# EAGLE design ActiveDebugger8p1 (EAGLE 9.6.2)
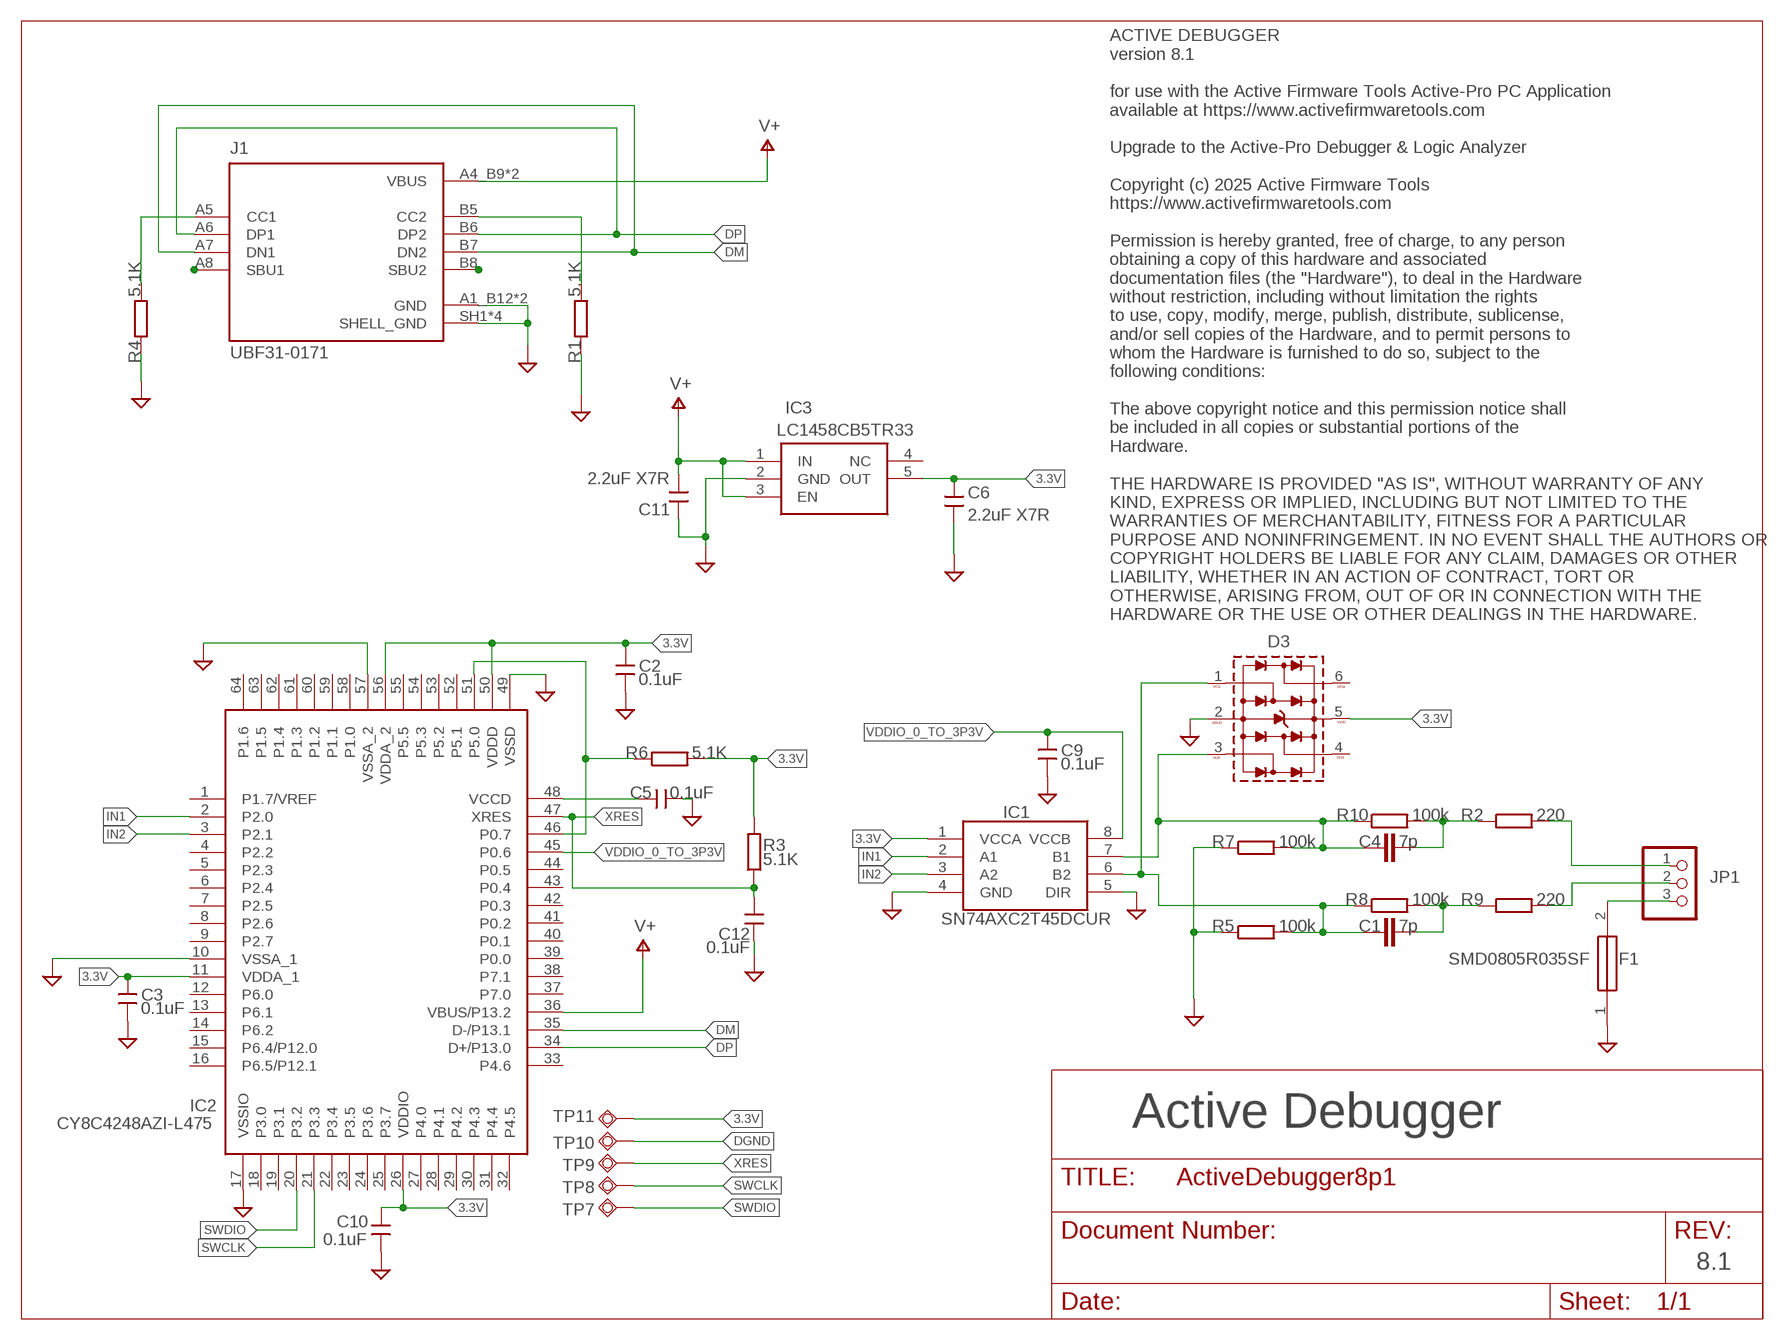
[diagram p0: schematic, sheet 1]

## Parts
C1  7p  C-EUC0603  [C0603]
C2  0.1uF  CAP0603  [0603]
C3  0.1uF  CAP0603  [0603]
C4  7p  C-EUC0603  [C0603]
C5  0.1uF  CAP0603  [0603]
C6  2.2uF X7R  CAP  [0805]
C9  0.1uF  CAP0603  [0603]
C10  0.1uF  CAP0603  [0603]
C11  2.2uF X7R  CAP  [0805]
C12  0.1uF  CAP0603  [0603]
D3  5Vdc  WE-TVS-HS_SC70-6L_82400274  [WE-TVS_SC70-6L]
F1  SMD0805R035SF  SMD0805B010TF  [FUSC2114X100N]
IC1  SN74AXC2T45DCUR  SN74AXCH2T45DCUR  [SOP50P310X90-8N]
IC2  CY8C4248AZI-L475  [QFP50P1200X1200X160-64N]
IC3  LC1458CB5TR33  TLV70233DBVR  [SOT95P280X145-5N]
J1  UBF31-0171  USB4105GFA120  [GCT_USB4105GFA120]
JP1  P125-1103A0BR138A1  PINHD-1X3  [1X03]
R1  5.1K  R-EU_R0603  [R0603]
R2  220  R-EU_R0603  [R0603]
R3  5.1K  R-EU_R0603  [R0603]
R4  5.1K  R-EU_R0603  [R0603]
R5  100k  R-EU_R0603  [R0603]
R6  5.1K  R-EU_R0603  [R0603]
R7  100k  R-EU_R0603  [R0603]
R8  100k  R-EU_R0603  [R0603]
R9  220  R-EU_R0603  [R0603]
R10  100k  R-EU_R0603  [R0603]
TP7  TPSQTP20R  [TP20R]
TP8  TPSQTP20R  [TP20R]
TP9  TPSQTP20R  [TP20R]
TP10  TPSQTP20R  [TP20R]
TP11  TPSQTP20SQ  [TP20SQ]

## Nets
3.3V: C2.1(X) C3.1(X) C6.2(Y) C10.1(X) D3.5(VDD) IC1.1(VCCA) IC2.11(VDDA_1) IC2.26(VDDIO) IC2.50(VDDD) IC2.56(VDDA_2) IC3.5(OUT) R3.2 R6.2 TP11.TP
DGND: C2.2(Y) C3.2(Y) C5.2(Y) C6.1(X) C9.2(Y) C10.2(Y) C11.1(X) C12.1(X) D3.2(GND) F1.1 IC1.4(GND) IC1.5(DIR) IC2.10(VSSA_1) IC2.17(VSSIO) IC2.49(VSSD) IC2.57(VSSA_2) IC3.2(GND) J1.A1_B12(GND) J1.B1_A12(GND) J1.SH1(SHELL_GND) J1.SH2(SHELL_GND) J1.SH3(SHELL_GND) J1.SH4(SHELL_GND) R1.1 R4.1 R5.1 R7.1 TP10.TP
DIN0: JP1.1 R2.2
DIN1: JP1.2 R9.2
DM: IC2.35(D-/P13.1) J1.A7(DN1) J1.B7(DN2)
DP: IC2.34(D+/P13.0) J1.A6(DP1) J1.B6(DP2)
DP0: C4.1 D3.3 IC1.7(B1) R7.2 R10.1
DP1: C1.1 D3.1 IC1.6(B2) R5.2 R8.1
IN1: IC1.2(A1) IC2.2(P2.0)
IN2: IC1.3(A2) IC2.3(P2.1)
N$3: C4.2 R2.1 R10.2
N$4: F1.2 JP1.3
N$5: IC2.46(P0.7) IC2.51(P5.0) R6.1
N$6: J1.A8(SBU1)
N$7: C5.1(X) IC2.48(VCCD)
N$8: J1.A5(CC1) R4.2
N$9: J1.B5(CC2) R1.2
N$10: J1.B8(SBU2)
N$11: C1.2 R8.2 R9.1
SWCLK: IC2.21(P3.3) TP8.TP
SWDIO: IC2.20(P3.2) TP7.TP
V+: C11.2(Y) IC2.36(VBUS/P13.2) IC3.1(IN) IC3.3(EN) J1.A4_B9(VBUS) J1.B4_A9(VBUS)
VDDIO_0_TO_3P3V: C9.1(X) IC1.8(VCCB) IC2.45(P0.6)
XRES: C12.2(Y) IC2.47(XRES) R3.1 TP9.TP
Unconnected: D3.4 D3.6 IC2.1(P1.7/VREF) IC2.4(P2.2) IC2.5(P2.3) IC2.6(P2.4) IC2.7(P2.5) IC2.8(P2.6) IC2.9(P2.7) IC2.12(P6.0) IC2.13(P6.1) IC2.14(P6.2) IC2.15(P6.4/P12.0) IC2.16(P6.5/P12.1) IC2.18(P3.0) IC2.19(P3.1) IC2.22(P3.4) IC2.23(P3.5) IC2.24(P3.6) IC2.25(P3.7) IC2.27(P4.0) IC2.28(P4.1) IC2.29(P4.2) IC2.30(P4.3) IC2.31(P4.4) IC2.32(P4.5) IC2.33(P4.6) IC2.37(P7.0) IC2.38(P7.1) IC2.39(P0.0) IC2.40(P0.1) IC2.41(P0.2) IC2.42(P0.3) IC2.43(P0.4) IC2.44(P0.5) IC2.52(P5.1) IC2.53(P5.2) IC2.54(P5.3) IC2.55(P5.5) IC2.58(P1.0) IC2.59(P1.1) IC2.60(P1.2) IC2.61(P1.3) IC2.62(P1.4) IC2.63(P1.5) IC2.64(P1.6) IC3.4(NC)

## Notes on the sheet
- ACTIVE DEBUGGER
  version 8.1
  
  for use with the Active Firmware Tools Active-Pro PC Application
  available at https://www.activefirmwaretools.com
  
  Upgrade to the Active-Pro Debugger & Logic Analyzer 
  
  Copyright (c) 2025 Active Firmware Tools
  https://www.activefirmwaretools.com
  
  Permission is hereby granted, free of charge, to any person
  obtaining a copy of this hardware and associated
  documentation files (the "Hardware"), to deal in the Hardware
  without restriction, including without limitation the rights
  to use, copy, modify, merge, publish, distribute, sublicense,
  and/or sell copies of the Hardware, and to permit persons to
  whom the Hardware is furnished to do so, subject to the
  following conditions:
  
  The above copyright notice and this permission notice shall
  be included in all copies or substantial portions of the
  Hardware.
  
  THE HARDWARE IS PROVIDED "AS IS", WITHOUT WARRANTY OF ANY
  KIND, EXPRESS OR IMPLIED, INCLUDING BUT NOT LIMITED TO THE 
  WARRANTIES OF MERCHANTABILITY, FITNESS FOR A PARTICULAR 
  PURPOSE AND NONINFRINGEMENT. IN NO EVENT SHALL THE AUTHORS OR
  COPYRIGHT HOLDERS BE LIABLE FOR ANY CLAIM, DAMAGES OR OTHER 
  LIABILITY, WHETHER IN AN ACTION OF CONTRACT, TORT OR 
  OTHERWISE, ARISING FROM, OUT OF OR IN CONNECTION WITH THE 
  HARDWARE OR THE USE OR OTHER DEALINGS IN THE HARDWARE.
- Active Debugger
- 8.1

## Library data of the parts
C1 C4 = rcl:C-EU: CAPACITOR, European symbol; SPICEPREFIX: C
C2 C3 C5 C9 C10 C12 = USBeeRX:CAP0603
C6 C11 = USBeeRX:CAP
D3 = Wurth_EMC Components_WE-TVS:WE-TVS-HS_SC70-6L_82400274: WE-TVS TVS Diode – High Speed Series Characteristics Low clamping voltage Sturdy design Very low capacitance Flow Thru Design for a simple layout Rail to Rail protection Epoxy flame resistant UL94-V0 RoHS, REACH and free of halogens Applications Very fast data lines USB 2.0 Ethernet PoE VGA Sim Cards Keypads HS = High Speed <https://katalog.we-online.com/media/images/v2/o14883v209%20Family_WE-TVS_HIGHSPEED.> Details see: https://katalog.we-online.com/en/pbs/WE-TVS-HS Updated by Ella Wu 2019-07-12 2019 (C) Wurth Elektronik; C-CH: 1.2pF; CHANNELS: 4+1; DATASHEET-URL: https://www.we-online.com/catalog/datasheet/82400274.pdf; IPEAK: 6A; MOUNT: SMT; PART-NUMBER: 82400274; VBR: 6V
F1 = SMD0805B010TF:SMD0805B010TF: YAGEO - SMD0805B010TF - Resettable Fuse, PPTC, 0805 (2012 Metric), SMD0805 Series, 15 VDC, 100 mA, 300 mA, 1.5 s Source: Datasheet <https://g.componentsearchengine.com/Datasheets/2/SMD0805B010TF.pdf>; DESCRIPTION: YAGEO - SMD0805B010TF - Resettable Fuse, PPTC, 0805 (2012 Metric), SMD0805 Series, 15 VDC, 100 mA, 300 mA, 1.5 s; HEIGHT: 1mm; MANUFACTURER_NAME: YAGEO; MANUFACTURER_PART_NUMBER: SMD0805B010TF; MOUSER_PART_NUMBER: 603-SMD0805B010TF; MOUSER_PRICE-STOCK: https://www.mouser.co.uk/ProductDetail/YAGEO/SMD0805B010TF?qs=0lSvoLzn4L8aJ%252BcBO9%2FecQ%3D%3D
IC1 = SN74AXCH2T45DCUR:SN74AXCH2T45DCUR: Translation - Voltage Levels 2-bit 0.65V to 3.6V AXC dual-supply bus transciever with bus-hold 8-VSSOP -40 to 125 Source: Datasheet <https://pdf1.alldatasheet.net/datasheet-pdf/view/1213154/TI1/SN74AXCH2T45DCUR.html>; DESCRIPTION: Translation - Voltage Levels 2-bit 0.65V to 3.6V AXC dual-supply bus transciever with bus-hold 8-VSSOP -40 to 125; HEIGHT: 0.9mm; MANUFACTURER_NAME: Texas Instruments; MANUFACTURER_PART_NUMBER: SN74AXCH2T45DCUR; MOUSER_PART_NUMBER: 595-SN74AXCH2T45DCUR; MOUSER_PRICE-STOCK: https://www.mouser.co.uk/ProductDetail/Texas-Instruments/SN74AXCH2T45DCUR?qs=rI7uf1IzohT8gFhA5W5%252Bog%3D%3D
IC2 = CY8C4248AZI-L475:CY8C4248AZI-L475: Cypress Semiconductor CY8C4248AZI-L475, 32bit ARM Cortex M0 Microcontroller, 48MHz, 256 kB Flash, 64-Pin TQFP Source: Datasheet <http://www.cypress.com/file/222206/download>; ARROW_PART_NUMBER: CY8C4248AZI-L475; ARROW_PRICE-STOCK: https://www.arrow.com/en/products/cy8c4248azi-l475/cypress-semiconductor; DESCRIPTION: Cypress Semiconductor CY8C4248AZI-L475, 32bit ARM Cortex M0 Microcontroller, 48MHz, 256 kB Flash, 64-Pin TQFP; HEIGHT: 1.6mm; MANUFACTURER_NAME: Infineon; MANUFACTURER_PART_NUMBER: CY8C4248AZI-L475
IC3 = TLV70233DBVR:TLV70233DBVR: 300mA Low-Iq Low-Dropout (LDO) Regulator for Portables Source: Datasheet <http://www.ti.com/lit/gpn/tlv702>; DESCRIPTION: 300mA Low-Iq Low-Dropout (LDO) Regulator for Portables; HEIGHT: 1.45mm; MANUFACTURER_NAME: Texas Instruments; MANUFACTURER_PART_NUMBER: TLV70233DBVR; MOUSER_PART_NUMBER: 595-TLV70233DBVR; MOUSER_PRICE-STOCK: https://www.mouser.co.uk/ProductDetail/Texas-Instruments/TLV70233DBVR?qs=zQ2yIHQ6k3wiHrD0NUI05Q%3D%3D
J1 = USB4105GFA120:USB4105GFA120; MANUFACTURER: Global Connector Technology; MAXIMUM_PACKAGE_HEIGHT: 3.31mm; PARTREV: B3; STANDARD: Manufacturer Recommendations
JP1 = pinhead:PINHD-1X3: PIN HEADER
R1-R10 = rcl:R-EU_: RESISTOR, European symbol; SPICEPREFIX: R
TP7-TP11 = testpad:TPSQ: Test pad

## Net classes
0 default: width 0.102 mm, drill 0.152 mm

## Board
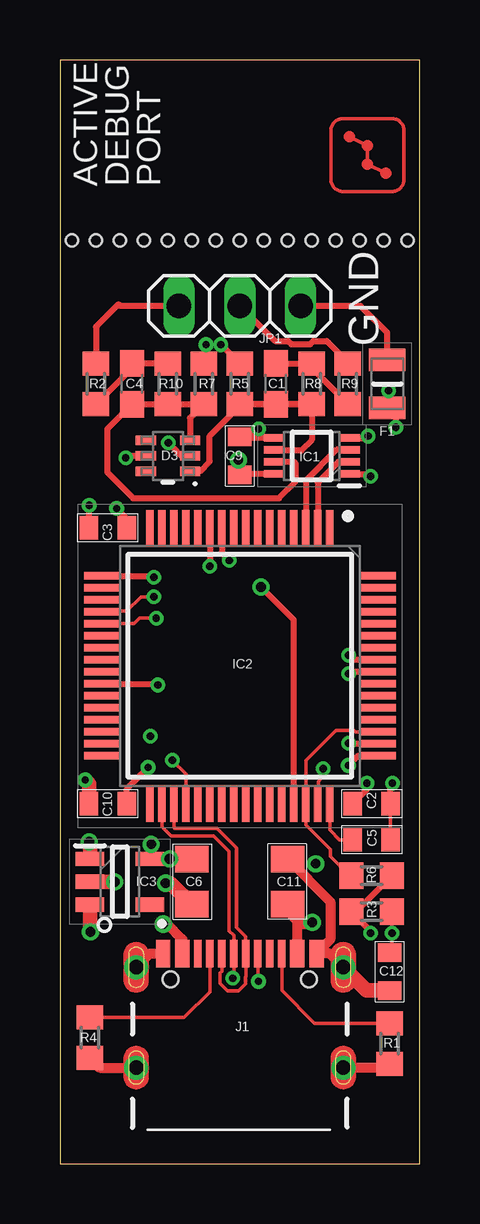
[diagram p1: board, top side]
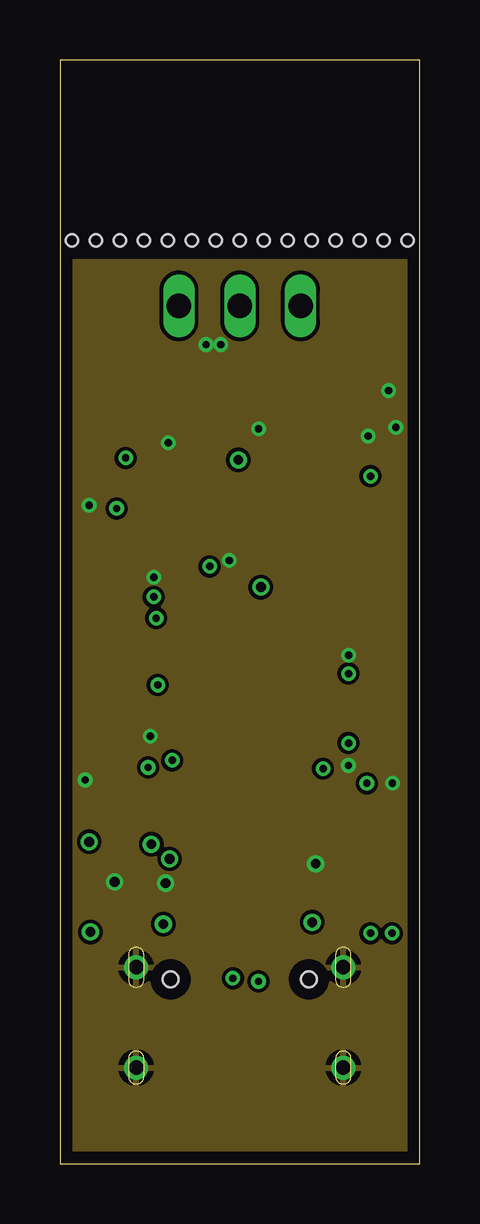
[diagram p2: board, inner layer GND]
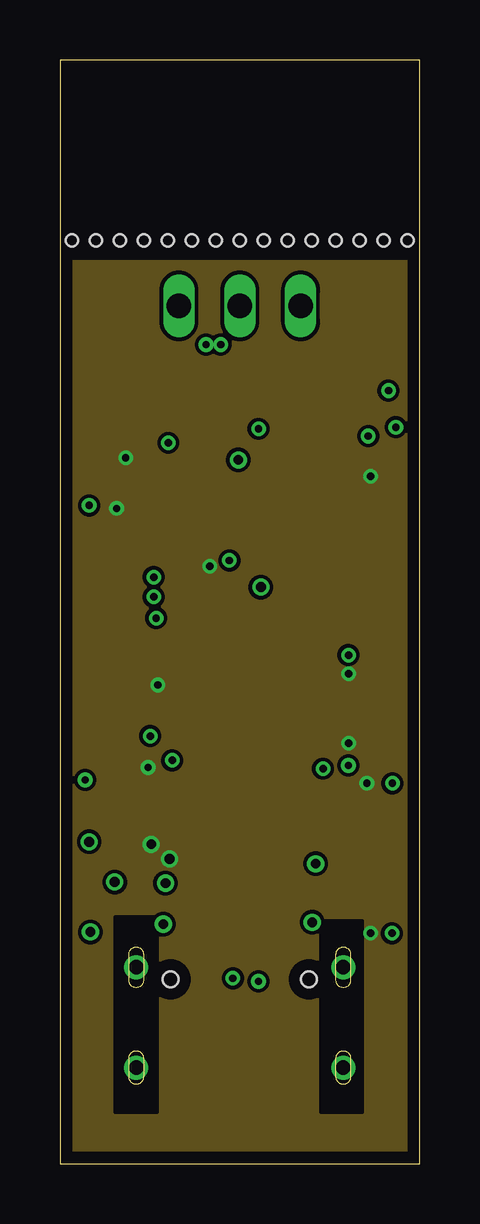
[diagram p3: board, inner layer POWER]
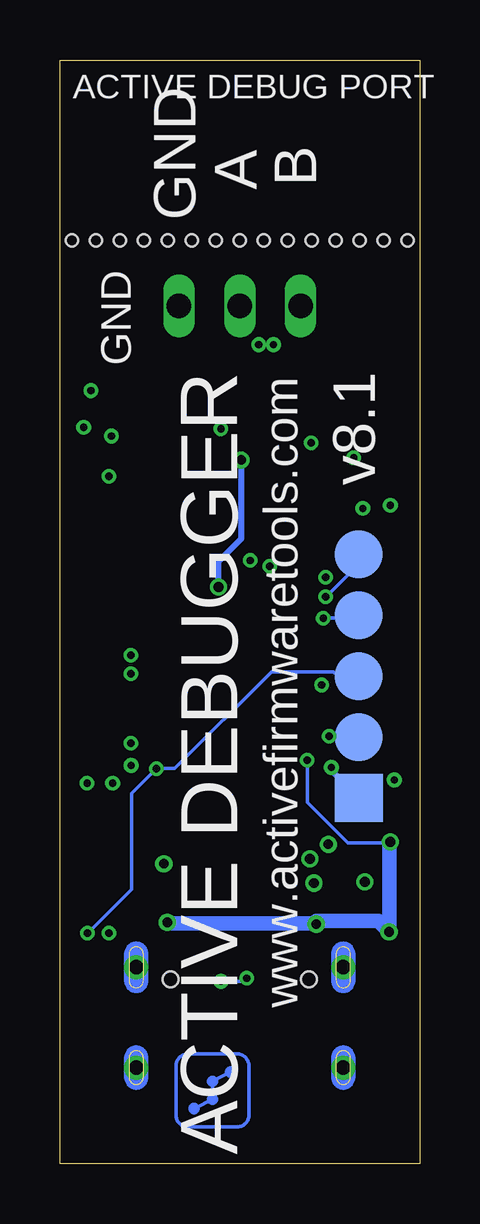
[diagram p4: board, bottom side, seen from below]

Size 15 x 46 mm. Coordinates in mm from the lower left corner, seen from the top.
Outline: 0,0 15,0 15,46 0,46 0,0
Copper layers (1+2*15+16): Top 0.035mm / dielectric 0.2mm / GND 0.035mm / dielectric 1.06mm / POWER 0.035mm / dielectric 0.2mm / Bottom 0.035mm
Design rules "default *": minimum track width 6mil, minimum drill 12mil, track to track 6mil, track to pad 6mil, pad to pad 6mil, via to via 6mil, smd to smd 0mil, copper to edge 20mil, drill to drill 10mil, minimum pad ring 6mil, minimum via ring 6mil, stop-mask expansion 1.5mil, vias tented up to drill 16mil, thermal gap 10mil
Holes 0.5 mm at 14.5,38.48 13.5,38.48 12.5,38.48 11.5,38.48 10.5,38.48 9.5,38.48 8.5,38.48 7.5,38.48 6.5,38.48 5.5,38.48 4.5,38.48 3.5,38.48 2.5,38.48 1.5,38.48 0.5,38.48

### Footprints (pad centres in the part's own frame; a part is rotated, then mirrored left to right if it is on the bottom)
C0603 = smd 1.1 x 1: 1 -0.85,0; 2 0.85,0
0603 = smd 0.762 x 0.965: 1 -0.787,0; 2 0.787,0
0805 = smd 1.092 x 1.397: 1 -0.94,0; 2 0.94,0
WE-TVS_SC70-6L = smd 0.4 x 0.85: 1 -0.65,-0.925; 2 0,-0.925; 3 0.65,-0.925; 4 0.65,0.925; 5 0,0.925; 6 -0.65,0.925
FUSC2114X100N = smd 0.93 x 1.52: 1 -1,0; 2 1,0
SOP50P310X90-8N = smd 0.85 x 0.3: 1 -1.575,0.75; 2 -1.575,0.25; 3 -1.575,-0.25; 4 -1.575,-0.75; 5 1.575,-0.75; 6 1.575,-0.25; 7 1.575,0.25; 8 1.575,0.75
QFP50P1200X1200X160-64N = smd 1.5 x 0.3: 1 -5.75,3.75; 2 -5.75,3.25; 3 -5.75,2.75; 4 -5.75,2.25; 5 -5.75,1.75; 6 -5.75,1.25; 7 -5.75,0.75; 8 -5.75,0.25; 9 -5.75,-0.25; 10 -5.75,-0.75; 11 -5.75,-1.25; 12 -5.75,-1.75; 13 -5.75,-2.25; 14 -5.75,-2.75; 15 -5.75,-3.25; 16 -5.75,-3.75; 33 5.75,-3.75; 34 5.75,-3.25; 35 5.75,-2.75; 36 5.75,-2.25; 37 5.75,-1.75; 38 5.75,-1.25; 39 5.75,-0.75; 40 5.75,-0.25; 41 5.75,0.25; 42 5.75,0.75; 43 5.75,1.25; 44 5.75,1.75; 45 5.75,2.25; 46 5.75,2.75; 47 5.75,3.25; 48 5.75,3.75 | smd 0.3 x 1.5: 17 -3.75,-5.75; 18 -3.25,-5.75; 19 -2.75,-5.75; 20 -2.25,-5.75; 21 -1.75,-5.75; 22 -1.25,-5.75; 23 -0.75,-5.75; 24 -0.25,-5.75; 25 0.25,-5.75; 26 0.75,-5.75; 27 1.25,-5.75; 28 1.75,-5.75; 29 2.25,-5.75; 30 2.75,-5.75; 31 3.25,-5.75; 32 3.75,-5.75; 49 3.75,5.75; 50 3.25,5.75; 51 2.75,5.75; 52 2.25,5.75; 53 1.75,5.75; 54 1.25,5.75; 55 0.75,5.75; 56 0.25,5.75; 57 -0.25,5.75; 58 -0.75,5.75; 59 -1.25,5.75; 60 -1.75,5.75; 61 -2.25,5.75; 62 -2.75,5.75; 63 -3.25,5.75; 64 -3.75,5.75
SOT95P280X145-5N = smd 1.2 x 0.6: 1 -1.25,0.95; 2 -1.25,0; 3 -1.25,-0.95; 4 1.25,-0.95; 5 1.25,0.95
GCT_USB4105GFA120 = smd 0.6 x 1.15: A1_B12 -3.2,4.755; A4_B9 -2.4,4.755; B1_A12 3.2,4.755; B4_A9 2.4,4.755 | smd 0.3 x 1.15: A5 -1.25,4.755; A6 -0.25,4.755; A7 0.25,4.755; A8 1.25,4.755; B5 1.75,4.755; B6 0.75,4.755; B7 -0.75,4.755; B8 -1.75,4.755 | drill 0.6 pad 1: SH1 -4.32,4.18; SH2 4.32,4.18; SH3 -4.32,0; SH4 4.32,0 | hole 0.65: 2.89,3.68; -2.89,3.68
1X03 = drill 1.016 long: 1 -2.54,0; 2 0,0; 3 2.54,0
R0603 = smd 1 x 1.1: 1 -0.85,0; 2 0.85,0
TP20R = smd 2 x 2: TP 0,0
TP20SQ = smd 2 x 2: TP 0,0

### Placement (x,y rotation side)
C1  9,32.5 90 top
C2  13,15 0 top
C3  2,26.5 180 top
C4  3,32.5 90 top
C5  13,13.5 0 top
C6  5.5,11.75 90 top
C9  7.5,29.5 90 top
C10  2,15 180 top
C11  9.5,11.75 270 top
C12  13.75,8 90 top
D3  4.5,29.5 90 top
F1  13.65,32.5 90 top
IC1  10.5,29.5 180 top
IC2  7.5,20.75 270 top
IC3  2.5,11.75 0 top
J1  7.5,4 0 top
JP1  7.5,35.75 0 top
R1  13.75,5 90 top
R2  1.5,32.5 90 top
R3  13,10.5 180 top
R4  1.25,5.25 90 top
R5  7.5,32.5 270 top
R6  13,12 0 top
R7  6,32.5 270 top
R8  10.5,32.5 90 top
R9  12,32.5 90 top
R10  4.5,32.5 90 top
TP7  2.54,25.4 0 bottom
TP8  2.54,22.86 0 bottom
TP9  2.54,20.32 0 bottom
TP10  2.54,17.78 0 bottom
TP11  2.54,15.24 0 bottom

### Tracks (layer width: path | path; a pad name or v marks a point on that pad's centre or on a via)
3.3V  (via drill 0.3, 0.41)
  Top 0.254: IC2.26 4.03,20 v4.08,19.95 | C3.1 2.79,26.88 v2.36,27.3 | IC2.11 v6.25,24.89 | IC2.56 12.12,20.5 v12.04,20.42 | IC2.50 12.07,17.5 v12.04,17.53 | v3.68,16.51 v3.68,16.5 2.79,15.61 C10.1 | D3.5 3.56,29.49 2.82,29.49 v2.74,29.41 | IC1.1 12.86,28.75 v12.95,28.65 | C2.1 12.8,15.59 v12.8,15.85 | R6.2 12.35,10.5 R3.2 12.95,9.7 v12.95,9.6
  Top 0.406: IC3.5 3.81,12.76 v3.81,13.31
  Top 0.61: IC3.5 v4.57,12.7 C6.2
  Bottom 0.254: v3.68,16.51 3.68,16.38 TP11.TP
  pour POWER: 0.33,0.46 14.54,0.46 14.54,37.6 0.33,37.6
DGND  (via drill 0.3, 0.41)
  Top 0.152: C5.2 C2.2
  Top 0.254: C2.2 13.79,15.77 v13.87,15.85 | IC2.17 3.85,24.5 v3.91,24.44 | IC2.10 6.75,25.47 6.83,25.39 6.83,25.37 v7.07,25.14 | IC2.57 12.29,21 12.28,21.01 12.23,21.01 v12.04,21.19 | IC2.49 12.44,17 v12.03,16.6 | C3.2 v1.21,27.43 v1.22,27.43 | v14.01,30.69 14.01,31.15 F1.1 13.65,32.17 v13.7,32.22 | IC1.4 12.79,30.25 v12.86,30.32 | R5.1 v6.71,34.14 | v6.1,34.14 6.1,33.45 R7.1 | v8.28,30.63 7.95,30.29 C9.2 7.54,30.25 IC1.5 | v4.52,30.04 4.72,29.84 4.72,29.83 5.05,29.5 D3.2
  Top 0.406: J1.SH2 11.24,8.76 J1.B1_A12 11.28,9.34 11.28,10.91 C11.1 | J1.SH1 3.75,8.76 J1.A1_B12 | R1.1 13.6,4 J1.SH4 | R4.1 1.65,4 J1.SH3
  Top 0.61: C12.1 12.79,7.21 J1.SH2 | IC3.2 2.27,11.75 v2.29,11.73 | C6.1 4.62,11.69 v4.4,11.69 | C10.2 1.21,15.83 v1.05,15.99
  Bottom 0.152: TP10.TP 3.73,17.78 v3.77,17.81
  other vias: 10.67,12.5
  pour GND (rank 2): 0.41,37.63 14.44,37.63 14.44,0.46 0.41,0.46
DIN0
  Top 0.254: JP1.1 2.5,35.75 2.44,35.81 1.5,34.88 R2.2
DIN1
  Top 0.254: JP1.2 8.96,34.29 9.51,34.29 9.65,34.15 10.43,34.15 10.57,34.29 11.12,34.29 12,33.41 R9.2
DM
  Top 0.152: IC2.35 4.75,13.99 4.78,13.97 6.55,13.97 7.37,13.15 7.37,9.84 7.73,9.47 7.73,8.78 J1.A7 7.75,7.79 7.75,7.49 7.44,7.19 6.99,7.19 6.68,7.5 6.68,7.94 6.75,8.01 J1.B7
DP  (via drill 0.3)
  Top 0.152: IC2.34 4.25,14.04 4.63,13.66 6.4,13.66 7.06,13 7.06,9.7 7.25,9.51 J1.A6 7.25,7.76 v7.21,7.72 | J1.B6 8.25,7.62 v8.28,7.59
  Bottom 0.152: v8.28,7.59 7.34,7.59 v7.21,7.72
DP0
  Top 0.254: D3.3 5.42,31.07 R7.2 R10.1 C4.1 1.98,30.63 1.98,28.8 3.05,27.74 9.14,27.74 9.84,28.44 9.84,29.17 9.76,29.25 IC1.7
DP1
  Top 0.254: R8.1 C1.1 7.57,31.65 6.25,30.33 6.25,29.26 5.84,28.85 D3.1 | R8.1 R5.2 | R8.1 10.5,30.16 10.06,29.72 8.96,29.72 IC1.6
IN1
  Top 0.254: IC1.2 11.61,29.25 10.75,28.39 IC2.2
IN2
  Top 0.254: IC1.3 11.53,29.75 10.25,28.47 IC2.3
N$1
  Top 0.152: 11.3,43.05 11.3,41.02 arc90 11.81,40.51 13.84,40.51 arc90 14.35,41.02 14.35,43.05 arc90 13.84,43.56 11.81,43.56 arc90 11.3,43.05
N$2
  Bottom 0.152: 7.11,4.06 7.11,2.03 arc90 7.62,1.52 9.65,1.52 arc90 10.16,2.03 10.16,4.06 arc90 9.65,4.57 7.62,4.57 arc90 7.11,4.06
N$3
  Top 0.254: R10.2 C4.2 3,33.15 R2.1
N$4
  Top 0.254: F1.2 13.65,34.64 12.54,35.75 JP1.3
N$5
  Top 0.152: IC2.46 | IC2.46 10.26,14.11 11.28,13.09 11.28,12.8 12.08,12 R6.1 | IC2.51 12.32,18 12.26,18.06 11.51,18.06 10.26,16.81 IC2.46
N$7
  Top 0.152: C5.1 11.65,13.5 11.25,13.9 IC2.48
N$8
  Top 0.152: R4.2 5.19,6.1 6.25,7.16 J1.A5
N$9
  Top 0.152: R1.2 10.61,5.85 9.25,7.21 J1.B5
N$11
  Top 0.254: C1.2 R8.2 10.5,33.15 R9.1
OUT1
  cutout POWER: 2.3,10.28 2.3,2.13 4.05,2.13 4.05,10.28
OUT2
  cutout POWER: 10.88,8.65 10.88,8.64 10.88,2.13 12.62,2.13 12.62,10.12 10.88,10.12
SWCLK  (via drill 0.3)
  Top 0.152: IC2.21 3.09,22.51 3.31,22.73 v4.01,22.73
  Bottom 0.152: v4.01,22.73 2.67,22.73 TP8.TP
SWDIO  (via drill 0.3)
  Top 0.152: IC2.20 1.78,23.03 2.79,23.03 3.38,23.62 v3.91,23.62
  Bottom 0.152: TP7.TP 2.54,24.99 v3.91,23.62
T
  Top 0.152: 12.07,42.8 12.83,42.42 12.83,41.66 13.59,41.28
T1
  Bottom 0.152: 7.88,3.81 8.64,3.43 8.64,2.67 9.4,2.29
V+  (via drill 0.3, 0.41)
  Top 0.152: IC2.36 5.25,16.24 v4.68,16.81
  Top 0.406: J1.B4_A9 9.9,9.97 10.44,9.97 v10.52,10.06 9.95,10.06 9.5,10.51 C11.2 | J1.A4_B9 5.1,9.35 4.46,9.98 v4.31,9.98
  Top 0.61: v1.27,9.65 1.25,9.67 IC3.3 | v1.22,13.41 1.25,13.38 IC3.1
  Bottom 0.152: v4.68,16.81 4.68,15.05 2.99,13.36 1.27,13.36
  Bottom 0.61: v10.52,10.06 10.47,10 4.31,10 | v1.22,13.41 1.27,13.36 v1.27,9.65 1.73,10.11 4.31,10.11 4.31,10 | 4.31,10 v4.31,9.98
VDDIO_0_TO_3P3V  (via drill 0.41)
  Top 0.254: IC2.45 9.75,22.66 v8.38,24.03 | C9.1 7.5,29.27 v7.44,29.33 7.44,29.05 7.74,28.75 IC1.8
  Bottom 0.254: v7.44,29.33 7.44,26.04 8.38,25.09 v8.38,24.03
XRES  (via drill 0.3)
  Top 0.152: R3.1 v13.85,9.6 13.85,8.89 C12.2 | v10.97,16.46 10.97,16.14 10.77,15.93 10.77,15.02 IC2.47
  Bottom 0.152: v13.85,9.6 12.01,11.44 12.01,15.42 v10.97,16.46 10.21,16.46 6.17,20.5 3.59,20.5 3.41,20.32 TP9.TP
(copper drawn outside any net)
  shapes: Bottom circle x4, Top circle x4

### Text on the board
tPlace: ACTIVE | DEBUG | PORT | GND
bPlace: ACTIVE DEBUG PORT | B | A | GND | GND | v8.1 | www.activefirmwaretools.com | ACTIVE DEBUGGER
Notes: ACTIVE DEBUGGER / / for use with the Active Firmware Tools Active-Pro PC Application / available at https://www.activefirmwaretools.com / / Upgrade to the Active-Pro Debugger & Logic Analyzer / / Copyright (c) 2025 Active Firmware Tools / https://www.activefirmwaretools.com / / Fab Details: / / Board Size: 15mm x 46mm / Board Thickness: 1.6mm / Board Layers: 4 (Top, Power, Ground, Bottom) / / License: / / Permission is hereby granted, free of charge, to any person / obtaining a copy of this hardware and associated / documentation files (the "Hardware"), to deal in the Hardware / without restriction, including without limitation the rights / to use, copy, modify, merge, publish, distribute, sublicense, / and/or sell copies of the Hardware, and to permit persons to / whom the Hardware is furnished to do so, subject to the / following conditions: / / The above copyright notice and this permission notice shall / be included in all copies or substantial portions of the / Hardware. / / THE HARDWARE IS PROVIDED "AS IS", WITHOUT WARRANTY OF ANY / KIND, EXPRESS OR IMPLIED, INCLUDING BUT NOT LIMITED TO THE / WARRANTIES OF MERCHANTABILITY, FITNESS FOR A PARTICULAR / PURPOSE AND NONINFRINGEMENT. IN NO EVENT SHALL THE AUTHORS OR / COPYRIGHT HOLDERS BE LIABLE FOR ANY CLAIM, DAMAGES OR OTHER / LIABILITY, WHETHER IN AN ACTION OF CONTRACT, TORT OR / OTHERWISE, ARISING FROM, OUT OF OR IN CONNECTION WITH THE / HARDWARE OR THE USE OR OTHER DEALINGS IN THE HARDWARE.